# Altium schematic sheet FRAM.SchDoc
size 420 x 297 mm
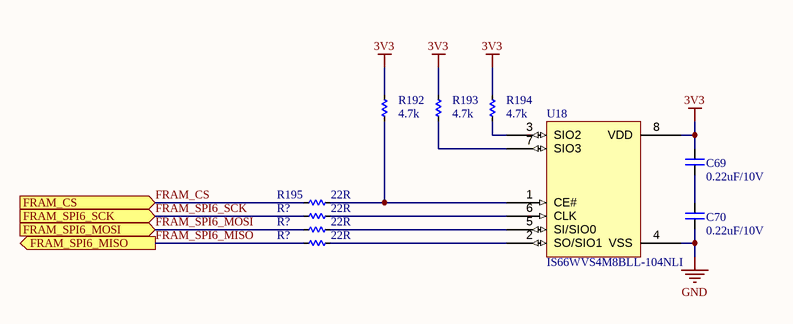
[diagram p0: FRAM.SchDoc]

## Parts
(Parts that share a designator on the sheet are numbered #1, #2 ... from top to bottom, then left to right.)
C69  0.22uF/10V  [CAP_C_1608X80]
C70  0.22uF/10V  [CAP_C_1608X80]
R192  4.7k  [RES_C_1608X60]
R193  4.7k  [RES_C_1608X60]
R194  4.7k  [RES_C_1608X60]
R195  22R  [RES_C_1608X60]
R?#1  22R  [RES_C_1608X60]
R?#2  22R  [RES_C_1608X60]
R?#3  22R  [RES_C_1608X60]
U18  IS66WVS4M8BLL-104NLI  [SOIC8_150MIL_N_ISI]

## Ports
FRAM_CS (in), FRAM_SPI6_MISO (out), FRAM_SPI6_MOSI (in), FRAM_SPI6_SCK (in)

## Nets
3V3: C69.2 R192.2 R193.2 R194.2 U18.8(VDD)
GND: C70.1 U18.4(VSS)
FRAM_CS: R195.1 ; port FRAM_CS
FRAM_SPI6_MISO: R?#3.1 ; port FRAM_SPI6_MISO
FRAM_SPI6_MOSI: R?#2.1 ; port FRAM_SPI6_MOSI
FRAM_SPI6_SCK: R?#1.1 ; port FRAM_SPI6_SCK
NetC69_1: C69.1 C70.2
NetR192_1: R192.1 R195.2 U18.1(CE#)
NetR193_1: R193.1 U18.7(SIO3)
NetR194_1: R194.1 U18.3(SIO2)
NetR?#1_2: R?#1.2 U18.6(CLK)
NetR?#2_2: R?#2.2 U18.5(SI/SIO0)
NetR?#3_2: R?#3.2 U18.2(SO/SIO1)

## Notes on the sheet
- Sub-system:
- Design by:
- Sheet title:
- Project:
- Sheet:
- of
- Checked by:
- Approved by:
- Doc no:
- Revision:
- Size:
- Date:

## Library data of the parts
C69 C70 = CAP_SMD: CAP_Chip; Value: 33pF
R192-R195 R?#1-R?#3 = _RES_B_2: RES
U18 = IS66WVS4M8BLL-104NLI: No Description Available; Manufacturer_Name: ISSI; Type: Memory; Copyright: Copyright (C) 2025 Ultra Librarian. All rights reserved.; Manufacturer_Part_Number: IS66WVS4M8BLL-104NLI; RefDes: RefDes